# EasyEDA schematic SCH_F题.json
TITLE: Sheet_1; REV: 1.0; Date: 2023-12-13; Sheet: 1/1; Drawn By: shrsky; Company: Your Company
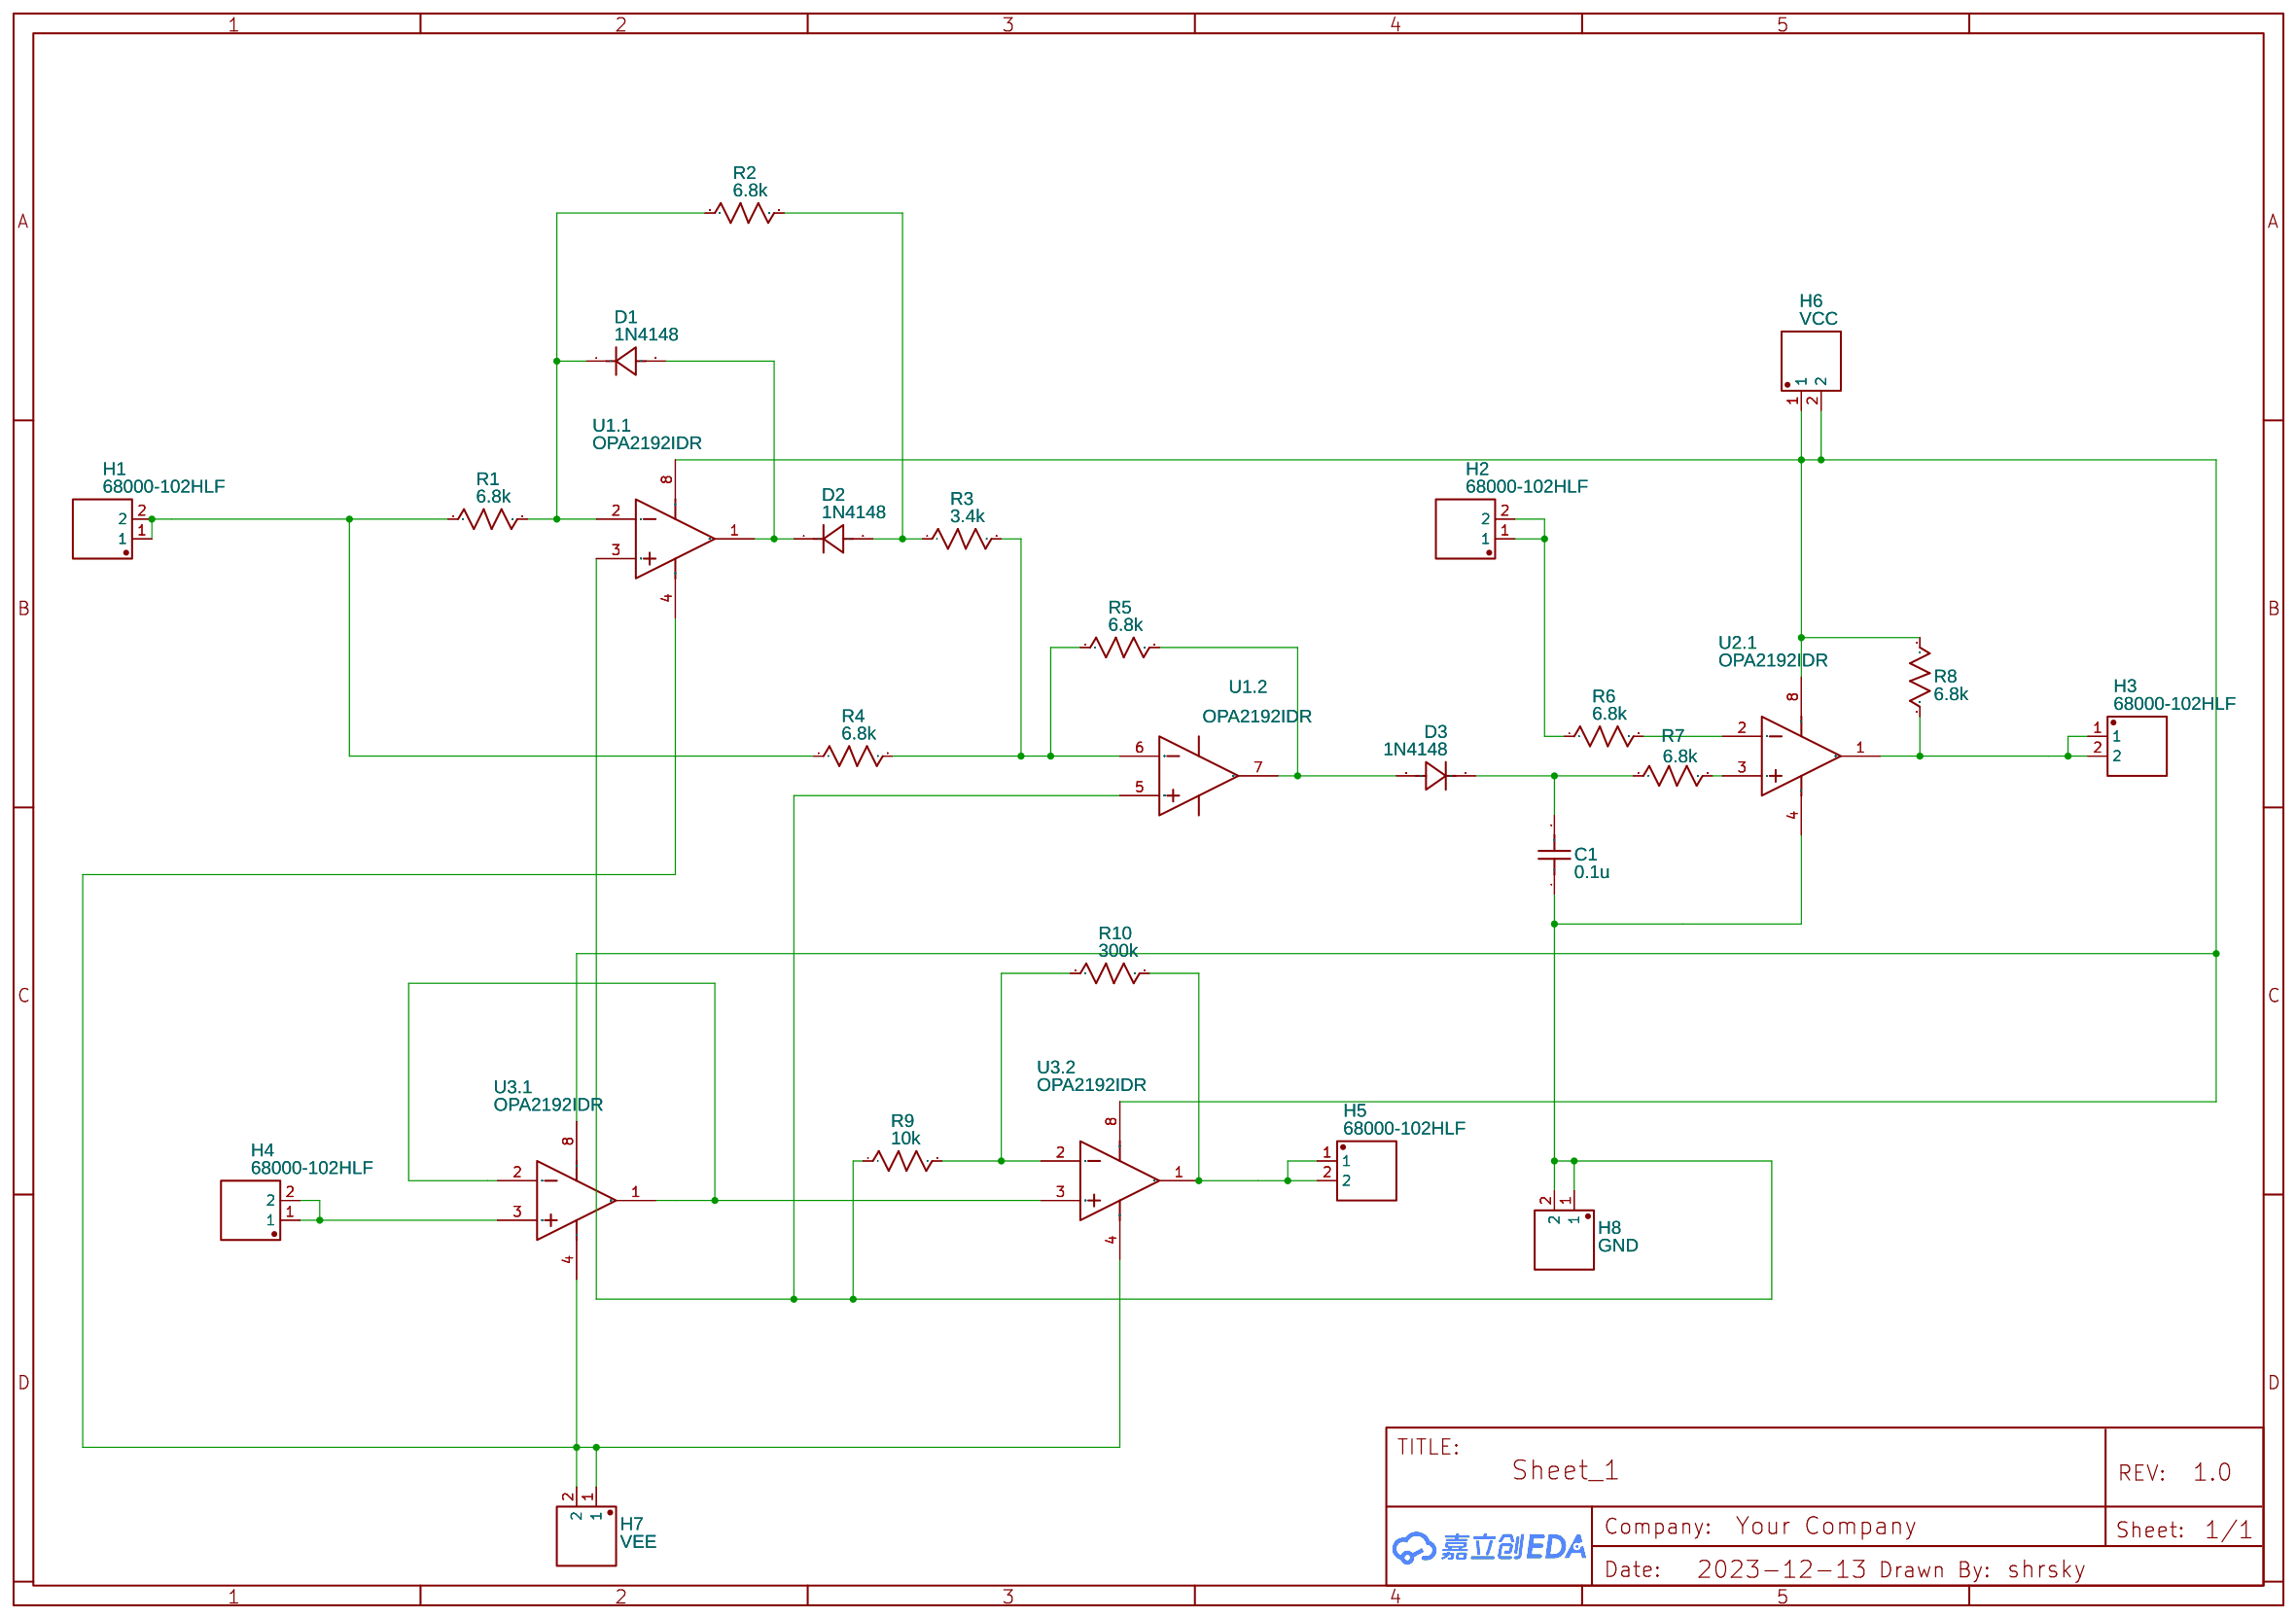
[diagram p0: schematic sheet]

## Parts
C1  0.1u  [C0603]
D1  1N4148  [SOD-323_L1.7-W1.3-LS2.5-RD]
D2  1N4148  [SOD-323_L1.7-W1.3-LS2.5-RD]
D3  1N4148  [SOD-323_L1.7-W1.3-LS2.5-RD]
H1  68000-102HLF  [HDR-TH_2P-P2.54-V-M-1]
H2  68000-102HLF  [HDR-TH_2P-P2.54-V-M-1]
H3  68000-102HLF  [HDR-TH_2P-P2.54-V-M-1]
H4  68000-102HLF  [HDR-TH_2P-P2.54-V-M-1]
H5  68000-102HLF  [HDR-TH_2P-P2.54-V-M-1]
H6  VCC  [HDR-TH_2P-P2.54-V-M-1]
H7  VEE  [HDR-TH_2P-P2.54-V-M-1]
H8  GND  [HDR-TH_2P-P2.54-V-M-1]
R1  6.8k  [R0603]
R2  6.8k  [R0603]
R3  3.4k  [R0603]
R4  6.8k  [R0603]
R5  6.8k  [R0603]
R6  6.8k  [R0603]
R7  6.8k  [R0603]
R8  6.8k  [R0603]
R9  10k  [R0603]
R10  300k  [R0603]
U1  OPA2192IDR  [SOIC-8_L4.9-W3.9-P1.27-LS6.0-BL]  (sections 1,2)
U2  OPA2192IDR  [SOIC-8_L4.9-W3.9-P1.27-LS6.0-BL]  (section 1)
U3  OPA2192IDR  [SOIC-8_L4.9-W3.9-P1.27-LS6.0-BL]  (sections 1,2)

## Library data of the parts
C1 = C_0603_US: Contributor: LCEDA_Lib
D1-D3 = 1N4148SOD-323: Contributor: lcsc; Supplier: LCSC; Supplier Part: C2972761; Manufacturer: JKSEMI(金开盛); JLCPCB Part Class: Extended Part
H1-H8 = 68000-102HLF: Contributor: LCSC; Supplier: LCSC; Supplier Part: C168673; Manufacturer: Amphenol; JLCPCB Part Class: Extended Part
R1-R10 = R_0603_US: Contributor: LCEDA_Lib
U1-U3 = OPA2192IDR: subpart_no: 1; Supplier: LCSC; Supplier Part: C110074; Manufacturer: TI(德州仪器); JLCPCB Part Class: Extended Part

## Nets
Net-(C1-1): C1.1 H8.1 H8.2 R9.1 U1.3(VINA+) U1.5(VINB+) U2.4(VSS)
Net-(C1-2): C1.2 D3.1(K) R7.1
Net-(D1-1): D1.1(K) R1.2 R2.1 U1.2(VINA-)
Net-(D1-2): D1.2(A) D2.1(K) U1.1(VOUTA)
Net-(D2-2): D2.2(A) R2.2 R3.1
Net-(D3-2): D3.2(A) R5.2 U1.7(VOUTB)
Net-(H1-1): H1.1 H1.2 R1.1 R4.1
Net-(H2-1): H2.1 H2.2 R6.1
Net-(H3-1): H3.1 H3.2 R8.2 U2.1(VOUTA)
Net-(H4-1): H4.1 H4.2
Net-(H5-1): H5.1 H5.2 R10.2 U3.1(VOUTA)
Net-(H6-1): H6.1 H6.2 R8.1 U1.8(VDD) U2.8(VDD) U3.8(VDD)
Net-(H7-1): H7.1 H7.2 U1.4(VSS) U3.4(VSS)
Net-(R3-2): R3.2 R4.2 R5.1 U1.6(VINB-)
Net-(R6-2): R6.2 U2.2(VINA-)
Net-(R7-2): R7.2 U2.3(VINA+)
Net-(R9-2): R9.2 R10.1 U3.2(VINA-)

Not connected (* = marked no-connect by the designer): U3 3(VINA+)
